# EAGLE schematic pro-one-mix-and-noise (EAGLE 5.07)
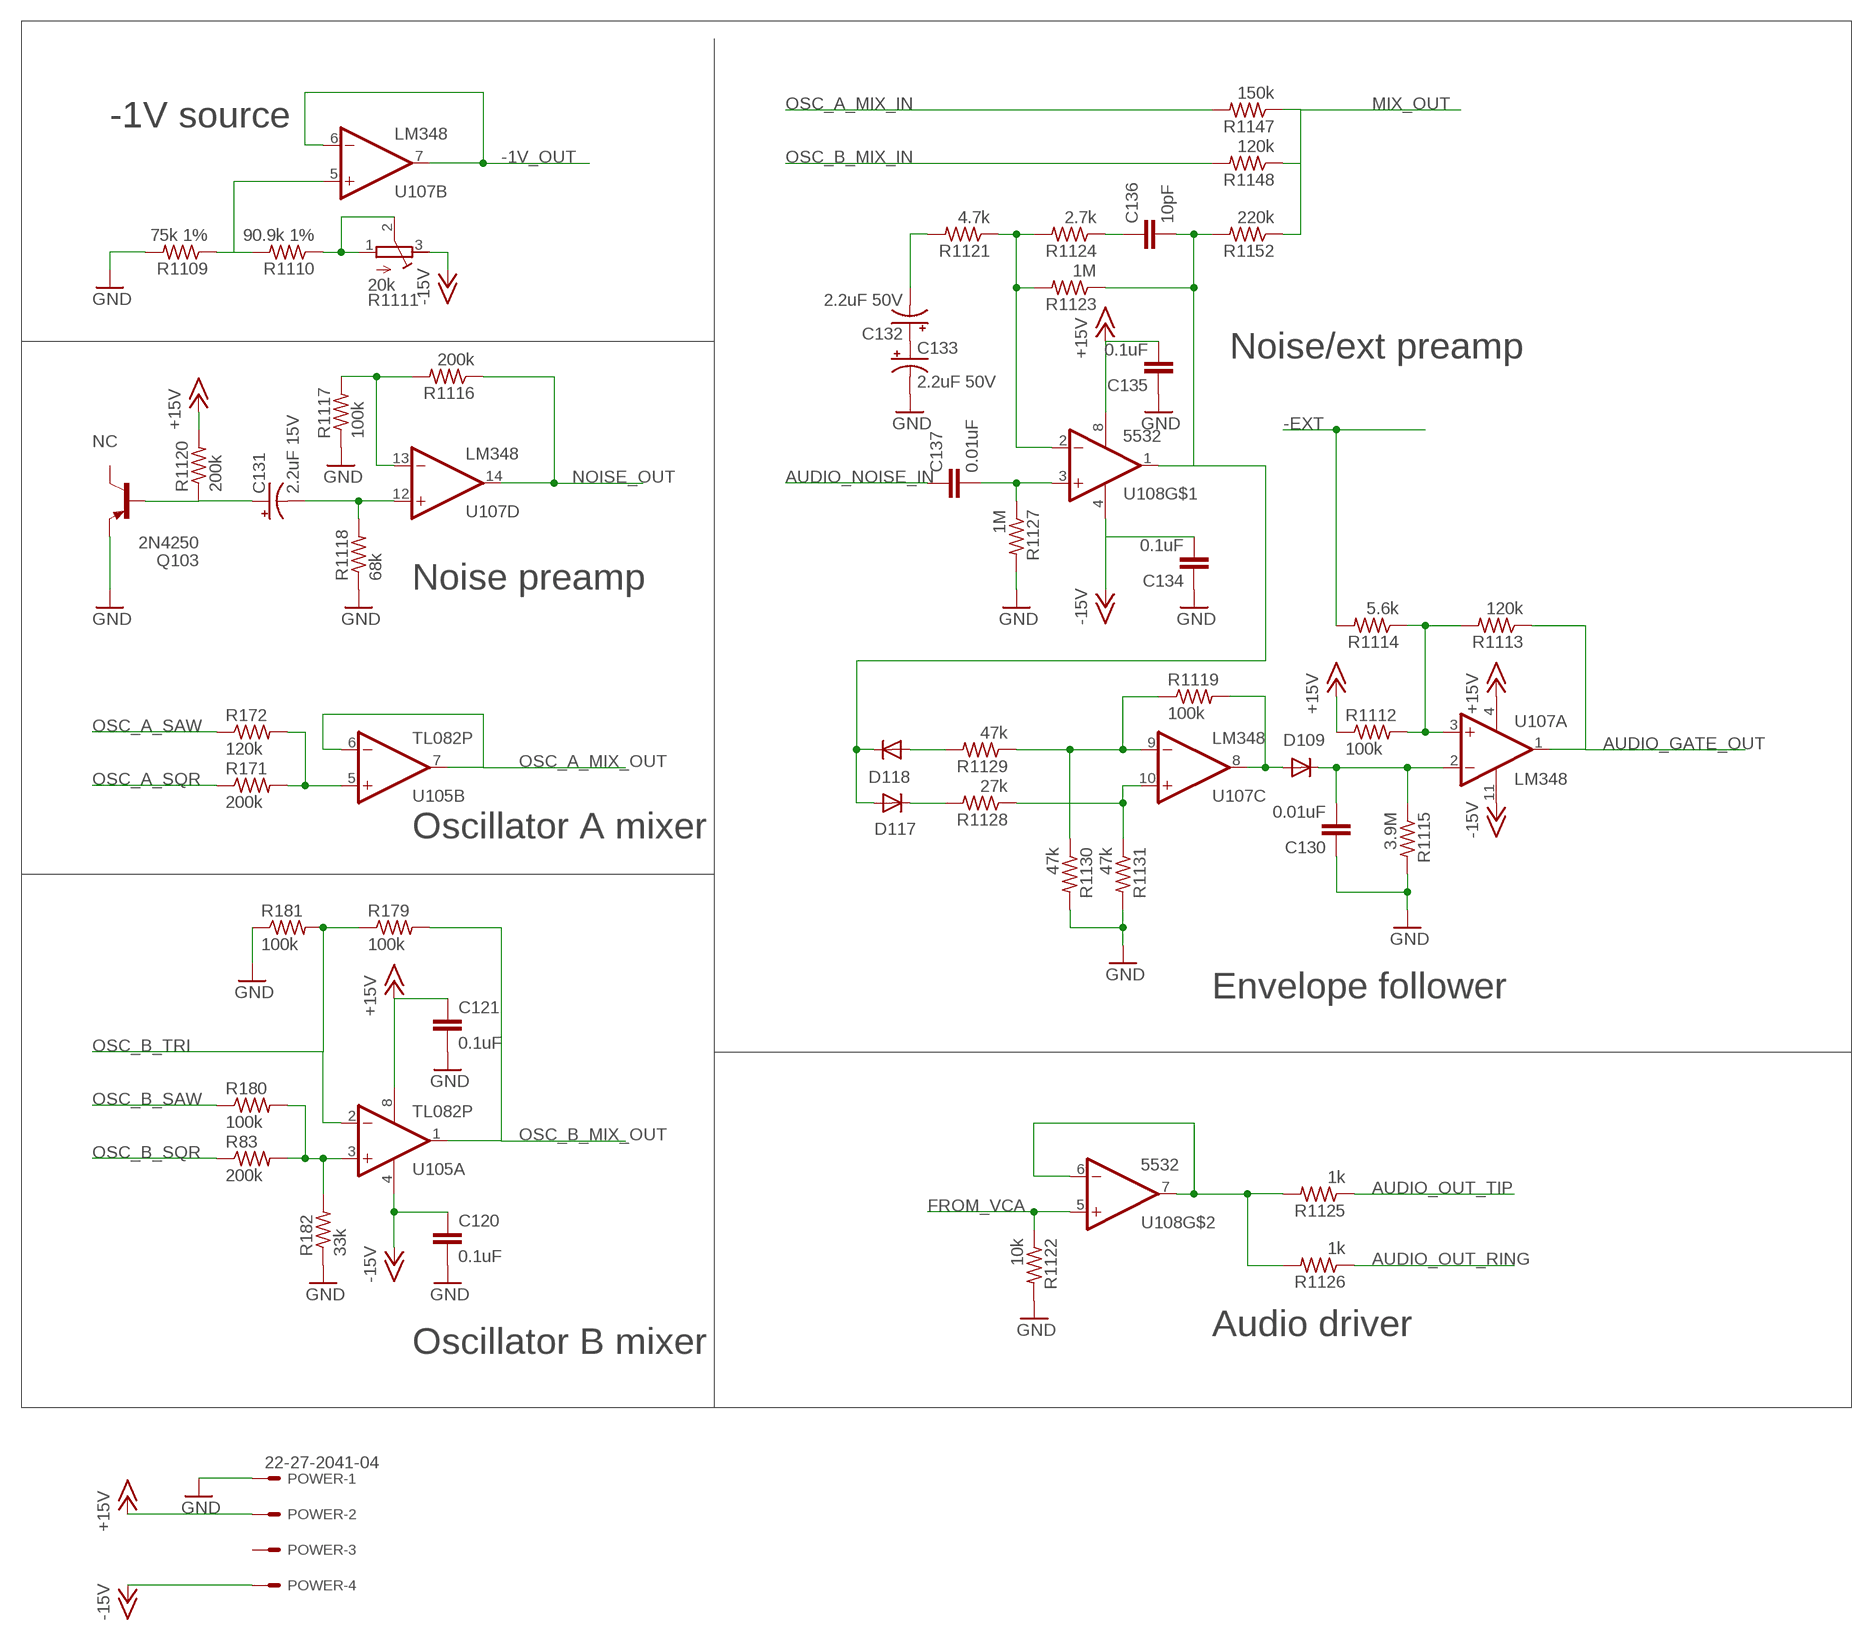
[diagram p0: schematic, sheet 1]

## Parts
C120  0.1uF  C-EU050-025X075  [C050-025X075]
C121  0.1uF  C-EU050-025X075  [C050-025X075]
C130  0.01uF  C-EU050-025X075  [C050-025X075]
C131  2.2uF 15V  CPOL-USE2.5-5  [E2,5-5]
C132  2.2uF 50V  CPOL-USE2.5-5  [E2,5-5]
C133  2.2uF 50V  CPOL-USE2.5-5  [E2,5-5]
C134  0.1uF  C-EU050-025X075  [C050-025X075]
C135  0.1uF  C-EU050-025X075  [C050-025X075]
C136  10pF  C-EU050-025X075  [C050-025X075]
C137  0.01uF  C-EU050-025X075  [C050-025X075]
D109  1N4148DO35-7  [DO35-7]
D117  1N4148DO35-7  [DO35-7]
D118  1N4148DO35-7  [DO35-7]
POWER  22-27-2041-04  [6410-04]
Q103  2N4250  [TO92]
R83  200k  R-US_0309/10  [0309/10]
R171  200k  R-US_0309/10  [0309/10]
R172  120k  R-US_0309/10  [0309/10]
R179  100k  R-US_0309/10  [0309/10]
R180  100k  R-US_0309/10  [0309/10]
R181  100k  R-US_0309/10  [0309/10]
R182  33k  R-US_0309/10  [0309/10]
R1109  75k 1%  R-US_0309/10  [0309/10]
R1110  90.9k 1%  R-US_0309/10  [0309/10]
R1111  20k  R-TRIMM64W  [RTRIM64W]
R1112  100k  R-US_0309/10  [0309/10]
R1113  120k  R-US_0309/10  [0309/10]
R1114  5.6k  R-US_0309/10  [0309/10]
R1115  3.9M  R-US_0309/10  [0309/10]
R1116  200k  R-US_0309/10  [0309/10]
R1117  100k  R-US_0309/10  [0309/10]
R1118  68k  R-US_0309/10  [0309/10]
R1119  100k  R-US_0309/10  [0309/10]
R1120  200k  R-US_0309/10  [0309/10]
R1121  4.7k  R-US_0309/10  [0309/10]
R1122  10k  R-US_0309/10  [0309/10]
R1123  1M  R-US_0309/10  [0309/10]
R1124  2.7k  R-US_0309/10  [0309/10]
R1125  1k  R-US_0309/10  [0309/10]
R1126  1k  R-US_0309/10  [0309/10]
R1127  1M  R-US_0309/10  [0309/10]
R1128  27k  R-US_0309/10  [0309/10]
R1129  47k  R-US_0309/10  [0309/10]
R1130  47k  R-US_0309/10  [0309/10]
R1131  47k  R-US_0309/10  [0309/10]
R1147  150k  R-US_0309/10  [0309/10]
R1148  120k  R-US_0309/10  [0309/10]
R1152  220k  R-US_0309/10  [0309/10]
U105  TL082P  [DIL08]
U107  LM348  [DIL14]
U108  5532  [DIL08]

## Nets
+15V: C121.1 C135.2 POWER.2 R1112.1 R1120.2 U105.8(P:V+) U107.4(P:V+) U108.8(V+)
-1V_OUT: U107.6(B:-IN) U107.7(B:OUT)
-15V: C120.1 C134.2 POWER.4 R1111.3(A) U105.4(P:V-) U107.11(P:V-) U108.4(V-)
-EXT: R1114.2
AUDIO_GATE_OUT: R1113.1 U107.1(A:OUT)
AUDIO_NOISE_IN: C137.1
AUDIO_OUT_RING: R1126.1
AUDIO_OUT_TIP: R1125.1
FROM_VCA: R1122.1 U108.5(+IN)
GND: C120.2 C121.2 C130.1 C133.- C134.1 C135.1 POWER.1 Q103.3(E) R181.1 R182.1 R1109.2 R1115.2 R1117.1 R1118.1 R1122.2 R1127.2 R1130.2 R1131.2
MIX_OUT: R1147.1 R1148.1 R1152.1
N$1: R171.2 R172.2 U105.5(B:+IN)
N$2: R83.2 R180.2 R182.2 U105.3(A:+IN)
N$3: C131.- R1118.2 U107.12(D:+IN)
N$4: C131.+ Q103.2(B) R1120.1
N$5: R1116.2 R1117.2 U107.13(D:-IN)
N$6: C132.+ C133.+
N$7: R1109.1 R1110.2 U107.5(B:+IN)
N$8: R1110.1 R1111.1(E) R1111.2(S)
N$9: C132.- R1121.2
N$10: D118.A R1129.2
N$11: C136.1 R1124.1
N$12: C136.2 D117.A D118.C R1123.1 R1152.2 U108.1(OUT)
N$13: C137.2 R1127.1 U108.3(+IN)
N$14: R1121.1 R1123.2 R1124.2 U108.2(-IN)
N$15: D117.C R1128.2
N$16: R1119.1 R1129.1 R1130.1 U107.9(C:-IN)
N$17: R1128.1 R1131.1 U107.10(C:+IN)
N$18: R1112.2 R1113.2 R1114.1 U107.3(A:+IN)
N$19: R1125.2 R1126.2 U108.6(-IN) U108.7(OUT)
N$21: D109.A R1119.2 U107.8(C:OUT)
N$22: C130.2 D109.C R1115.1 U107.2(A:-IN)
NOISE_OUT: R1116.1 U107.14(D:OUT)
OSC_A_MIX_IN: R1147.2
OSC_A_MIX_OUT: U105.6(B:-IN) U105.7(B:OUT)
OSC_A_SAW: R172.1
OSC_A_SQR: R171.1
OSC_B_MIX_IN: R1148.2
OSC_B_MIX_OUT: R179.2 U105.1(A:OUT)
OSC_B_SAW: R180.1
OSC_B_SQR: R83.1
OSC_B_TRI: R179.1 R181.2 U105.2(A:-IN)
Unconnected: POWER.3 Q103.1(C)

## Notes on the sheet
- -1V source
- Noise/ext preamp
- NC
- Noise preamp
- Oscillator A mixer
- Envelope follower
- Audio driver
- Oscillator B mixer

## Library data of the parts
C120 C121 C130 C134-C137 = resistor:C-EU: CAPACITOR, European symbol
C131-C133 = rcl:CPOL-US: POLARIZED CAPACITOR, American symbol
D109 D117 D118 = diode:1N4148: DIODE high speed (Philips)
POWER = con-molex:22-?-04: CONNECTOR wire to board 2.54 mm (.1 inch) pitch header
Q103 = joakim:2N4250: PNP Transistor
R83 R171 R172 R179-R182 R1109 R1110 R1112-R1131 R1147 R1148 R1152 = resistor:R-US_: RESISTOR, American symbol
R1111 = resistor:R-TRIMM: Trimm resistor
U105 = linear:TL082: OP AMP
U107 = joakim:LM348: Quad General Purpose, Low Voltage, Operational Amplifiers
U108 = joakim:5532: DUAL LOW-NOISE OPERATIONAL AMPLIFIERS